# Altium schematic sheet 磁悬浮原理图.SchDoc
size A4
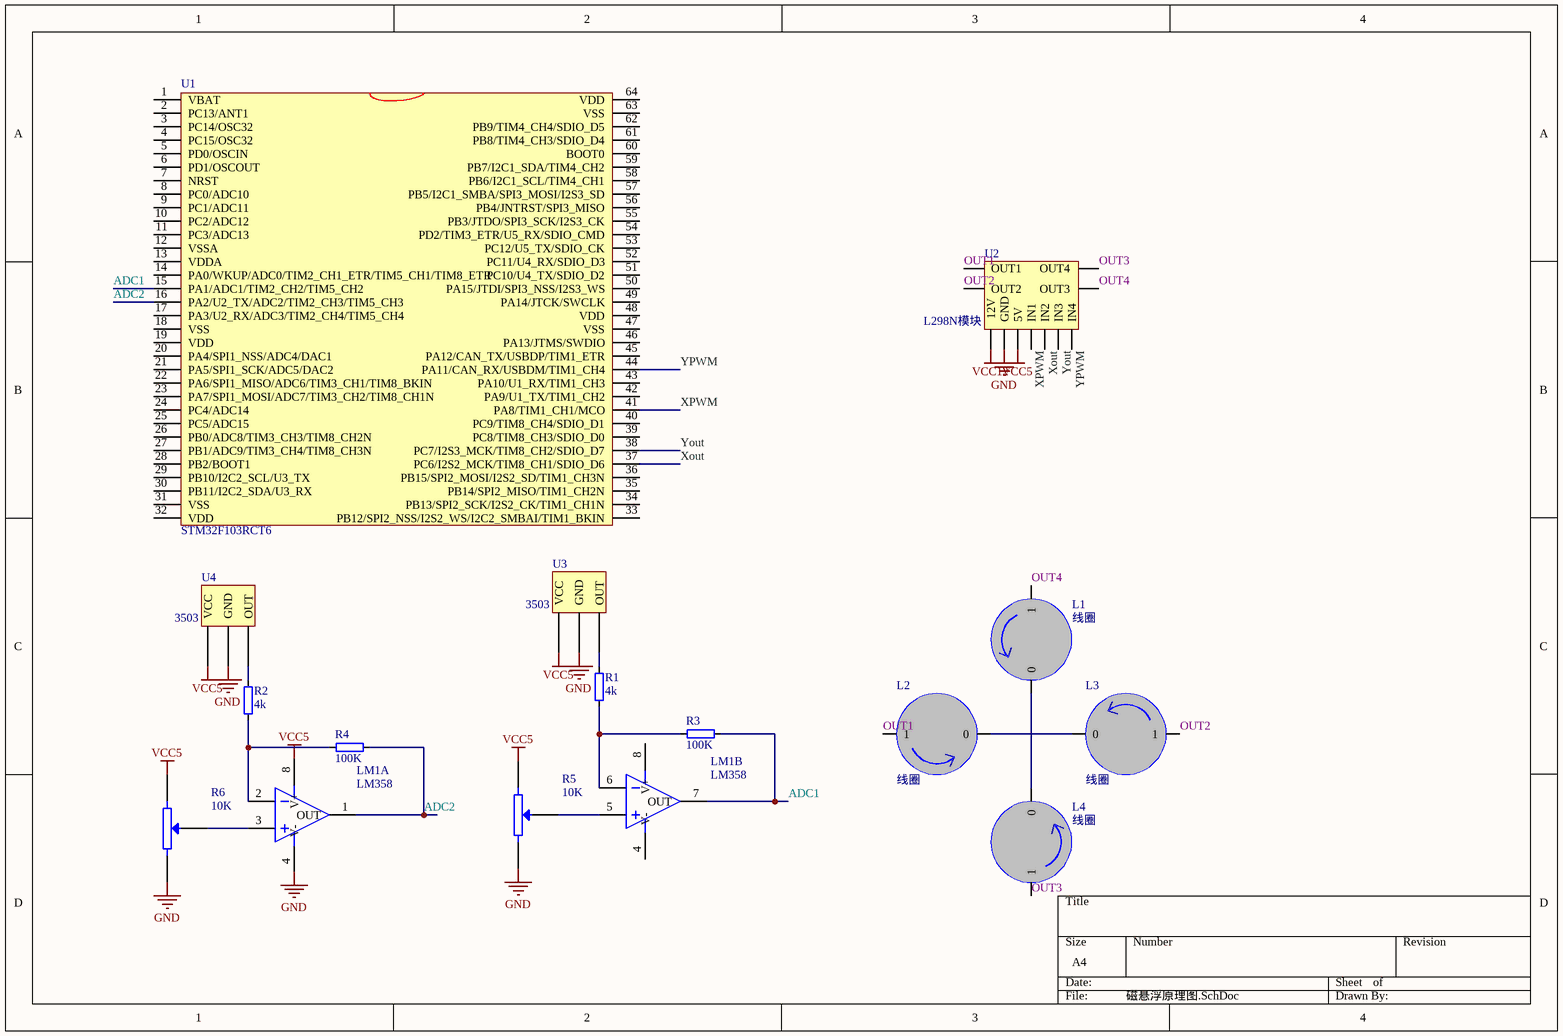
[diagram p0: 磁悬浮原理图.SchDoc]

## Parts
L1  线圈  [线圈]
L2  线圈  [线圈]
L3  线圈  [线圈]
L4  线圈  [线圈]
LM1  LM358  [SOIC-8]  (parts A,B of 2)
R1  4k  [RES_0805]
R2  4k  [RES_0805]
R3  100K  [RES_0805]
R4  100K  [RES_0805]
R5  10K  [VR]
R6  10K  [VR]
U1  STM32F103RCT6  [LQFP64]
U2  L298N模块
U3  3503
U4  3503

## Nets
GND: LM1.4(V-) R5.2 R6.2 U2.2(GND) U3.2(GND) U4.2(GND)
VCC5: LM1.8(V+) R5.1 R6.1 U2.3(5V) U3.1(VCC) U4.1(VCC)
VCC12: U2.1(12V)
ADC1: LM1.7(OUT) R3.1 U1.15(PA1/ADC1/TIM2_CH2/TIM5_CH2)
ADC2: LM1.1(OUT) R4.1 U1.16(PA2/U2_TX/ADC2/TIM2_CH3/TIM5_CH3)
OUT1: L2.1 U2.10(OUT1)
OUT2: L3.1 U2.9(OUT2)
OUT3: L4.1 U2.11(OUT4)
OUT4: L1.1 U2.12(OUT3)
Xout: U1.37(PC6/I2S2_MCK/TIM8_CH1/SDIO_D6) U2.5(IN2)
XPWM: U1.41(PA8/TIM1_CH1/MCO) U2.4(IN1)
Yout: U1.38(PC7/I2S3_MCK/TIM8_CH2/SDIO_D7) U2.6(IN3)
YPWM: U1.44(PA11/CAN_RX/USBDM/TIM1_CH4) U2.7(IN4)
NetL1_0: L1.0 L4.0
NetL2_0: L2.0 L3.0
NetLM1_2: LM1.2(IN-) R2.1 R4.2
NetLM1_3: LM1.3(IN+) R6.3(W)
NetLM1_5: LM1.5(IN+) R5.3(W)
NetLM1_6: LM1.6(IN-) R1.1 R3.2
NetR1_2: R1.2 U3.3(OUT)
NetR2_2: R2.2 U4.3(OUT)

Not connected (* = marked no-connect by the designer): U1 1(VBAT) 2(PC13/ANT1) 3(PC14/OSC32) 4(PC15/OSC32) 5(PD0/OSCIN) 6(PD1/OSCOUT) 7(NRST) 8(PC0/ADC10) 9(PC1/ADC11) 10(PC2/ADC12) 11(PC3/ADC13) 12(VSSA) 13(VDDA) 14(PA0/WKUP/ADC0/TIM2_CH1_ETR/TIM5_CH1/TIM8_ETR) 17(PA3/U2_RX/ADC3/TIM2_CH4/TIM5_CH4) 18(VSS) 19(VDD) 20(PA4/SPI1_NSS/ADC4/DAC1) 21(PA5/SPI1_SCK/ADC5/DAC2) 22(PA6/SPI1_MISO/ADC6/TIM3_CH1/TIM8_BKIN) 23(PA7/SPI1_MOSI/ADC7/TIM3_CH2/TIM8_CH1N) 24(PC4/ADC14) 25(PC5/ADC15) 26(PB0/ADC8/TIM3_CH3/TIM8_CH2N) 27(PB1/ADC9/TIM3_CH4/TIM8_CH3N) 28(PB2/BOOT1) 29(PB10/I2C2_SCL/U3_TX) 30(PB11/I2C2_SDA/U3_RX) 31(VSS) 32(VDD) 33(PB12/SPI2_NSS/I2S2_WS/I2C2_SMBAI/TIM1_BKIN) 34(PB13/SPI2_SCK/I2S2_CK/TIM1_CH1N) 35(PB14/SPI2_MISO/TIM1_CH2N) 36(PB15/SPI2_MOSI/I2S2_SD/TIM1_CH3N) 39(PC8/TIM8_CH3/SDIO_D0) 40(PC9/TIM8_CH4/SDIO_D1) 42(PA9/U1_TX/TIM1_CH2) 43(PA10/U1_RX/TIM1_CH3) 45(PA12/CAN_TX/USBDP/TIM1_ETR) 46(PA13/JTMS/SWDIO) 47(VSS) 48(VDD) 49(PA14/JTCK/SWCLK) 50(PA15/JTDI/SPI3_NSS/I2S3_WS) 51(PC10/U4_TX/SDIO_D2) 52(PC11/U4_RX/SDIO_D3) 53(PC12/U5_TX/SDIO_CK) 54(PD2/TIM3_ETR/U5_RX/SDIO_CMD) 55(PB3/JTDO/SPI3_SCK/I2S3_CK) 56(PB4/JNTRST/SPI3_MISO) 57(PB5/I2C1_SMBA/SPI3_MOSI/I2S3_SD) 58(PB6/I2C1_SCL/TIM4_CH1) 59(PB7/I2C1_SDA/TIM4_CH2) 60(BOOT0) 61(PB8/TIM4_CH3/SDIO_D4) 62(PB9/TIM4_CH4/SDIO_D5) 63(VSS) 64(VDD)

## Library data of the parts
R1-R4 = RES
R5 R6 = RESVR: Potentiometer
U1 = STM32F103RDT6
U2 = L298N